# EAGLE design RJ45_Buffer (EAGLE 8.6.0)
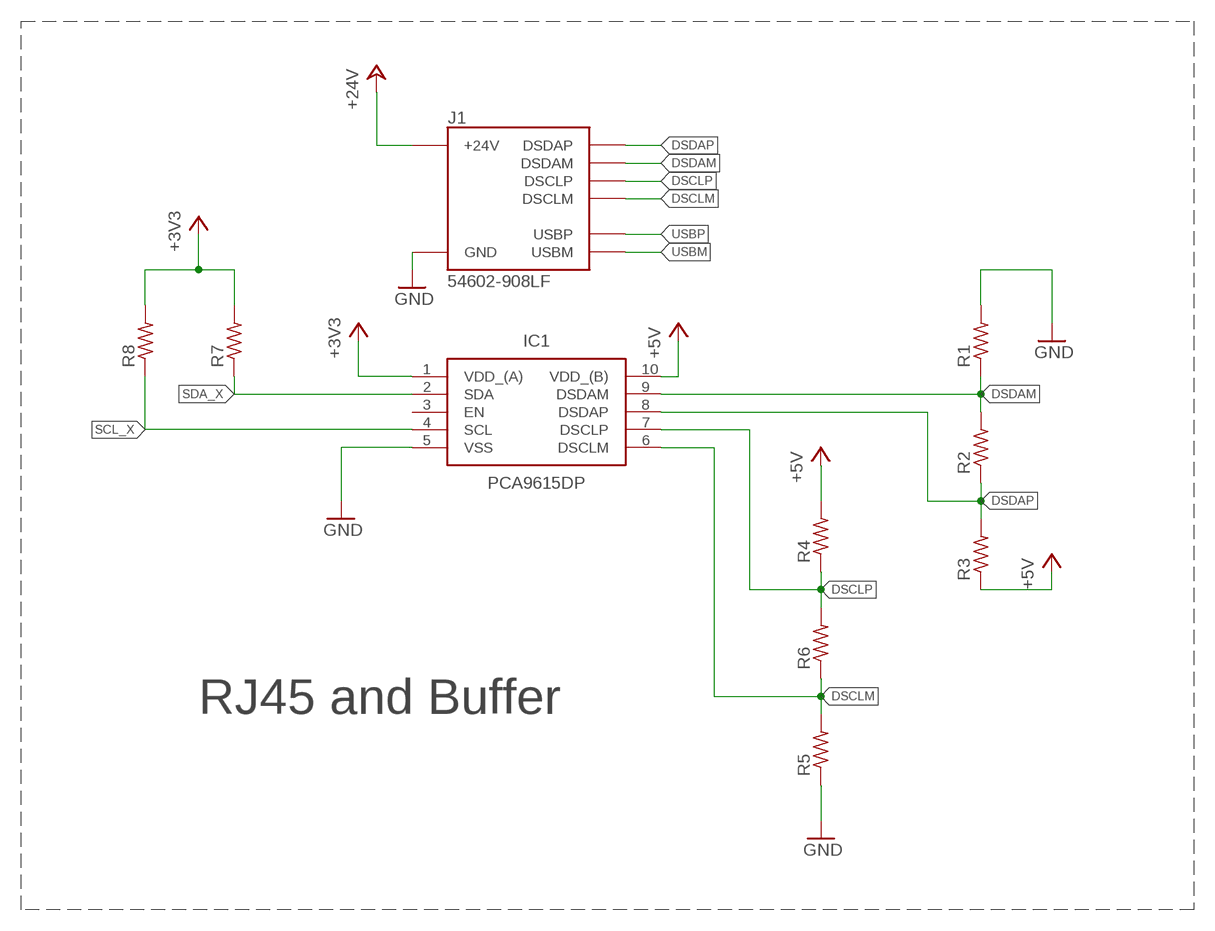
[diagram p0: schematic, sheet 1]

## Parts
IC1  PCA9615DP  [SOP50P490X110-10N]
J1  54602-908LF  OPENAG-V1-RJ45PTH  [OPENAG-V1-RJ45]
R1  R-US_R0603  [R0603]
R2  R-US_R0603  [R0603]
R3  R-US_R0603  [R0603]
R4  R-US_R0603  [R0603]
R5  R-US_R0603  [R0603]
R6  R-US_R0603  [R0603]
R7  R-US_R0603  [R0603]
R8  R-US_R0603  [R0603]

## Nets
+3V3: IC1.1(VDD_(A)) R7.2 R8.2
+5V: IC1.10(VDD_(B)) R3.1 R4.2
+24V: J1.24V(6)(+24V)
DSCLM: IC1.6(DSCLM) J1.DSCLM(5)(DSCLM) R5.2 R6.1
DSCLP: IC1.7(DSCLP) J1.DSCLP(4)(DSCLP) R4.1 R6.2
DSDAM: IC1.9(DSDAM) J1.DSDAM(2)(DSDAM) R1.1 R2.2
DSDAP: IC1.8(DSDAP) J1.DSDAP(1)(DSDAP) R2.1 R3.2
GND: IC1.5(VSS) J1.GND(3)(GND) R1.2 R5.1
SCL_X: IC1.4(SCL) R8.1
SDA_X: IC1.2(SDA) R7.1
USBM: J1.USBM(8)(USBM)
USBP: J1.USBP(7)(USBP)
Unconnected: IC1.3(EN)

## Notes on the sheet
- RJ45 and Buffer

## Library data of the parts
IC1 = PCA9615DP:PCA9615DP: Buffer, ReDriver 2 Channel 400kHz 10-TSSOP Source: Datasheet <http://www.nxp.com/docs/en/data-sheet/PCA9615.pdf>; DESCRIPTION: Buffer, ReDriver 2 Channel 400kHz 10-TSSOP; HEIGHT: 1.1mm; MANUFACTURER_NAME: Nexperia; MANUFACTURER_PART_NUMBER: PCA9615DP; SUPPLIER_NAME: RS
J1 = openag_connector:OPENAG-V1-RJ45: Amphenol FCI - 54602-908LF - CONN MOD JACK 8P8C R/A UNSHLD Description: Jack Modular Connector 8p8c (RJ45, Ethernet) 90� Angle (Right) Unshielded Cat3 Technical Specifications: Connector Type: Jack Number of Positions/Contacts: 8p8c (RJ45, Ethernet) Number of Ports: 1 Number of Rows: 1 Mounting Type: Through Hole Orientation: 90� Angle (Right) Termination: Solder Shielding: Unshielded Ratings: Cat3 Features: Board Lock LED Color: Does Not Contain LED Tab Direction: Down Contact Material: Copper Alloy Contact Finish: Gold Contact Finish Thickness: 15�in (0.38�m) Housing Material: Polyester, Glass Filled Operating Temperature: -40�C ~ 70�C Datasheet(s): 54601-x04(zzz)WPLF Drawing <http://cdn.amphenol-icc.com/media/wysiwyg/files/drawing/c-bmj-0102.pdf> Vendor(s): Digikey: 609-1046-ND <https://www.digikey.com/product-detail/en/amphenol-fci/54602-908LF/609-1046-ND/1001360>; POPULATE: YES; VERIFIED: NO
R1-R8 = rcl:R-US_: RESISTOR, American symbol; SPICEPREFIX: R

## Board
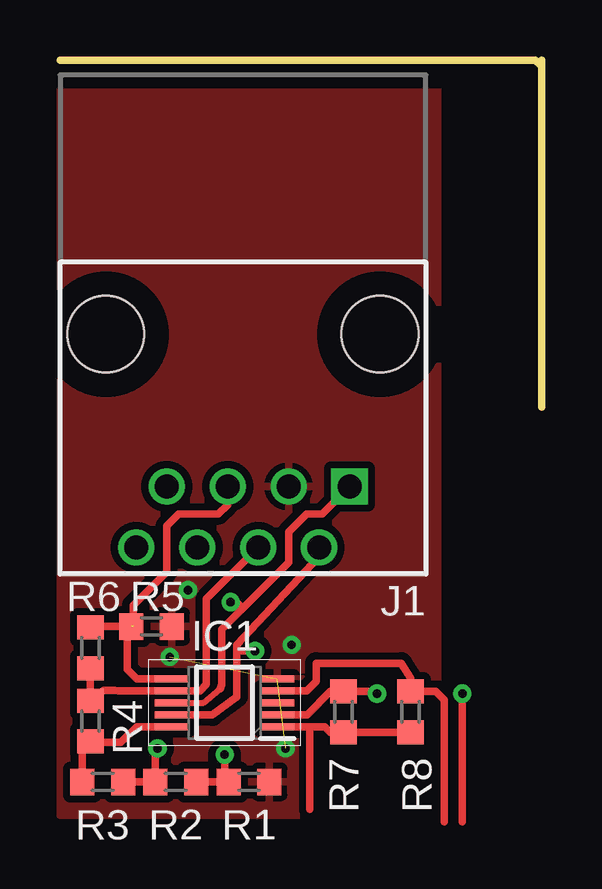
[diagram p1: board, top side]
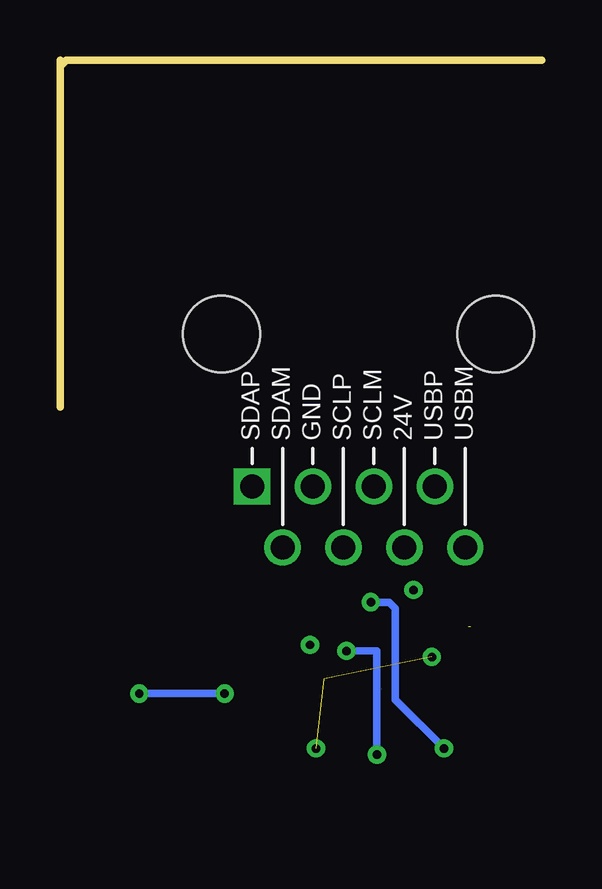
[diagram p2: board, bottom side, seen from below]

Size 20.07 x 14.48 mm. Coordinates in mm from the lower left corner, seen from the top.
Outline: 20.07,14.22 20.07,14.48 0,14.48 19.81,14.48 20.07,14.22
Outline: 20.07,14.22 20.07,0
Copper layers (1*16): Top 0.035mm / dielectric 1.5mm / Bottom 0.035mm
Design rules "default": minimum track width 6mil, minimum drill 0.35mm, track to track 6mil, track to pad 6mil, pad to pad 6mil, via to via 6mil, smd to smd 6mil, copper to edge 40mil, drill to drill 6mil, minimum pad ring 10mil, minimum via ring 8mil, stop-mask expansion 4mil, vias tented up to drill 0mil, thermal gap 10mil

### Footprints (pad centres in the part's own frame; a part is rotated, then mirrored left to right if it is on the bottom)
SOP50P490X110-10N = smd 1.4 x 0.3: 1 -2.2,1; 2 -2.2,0.5; 3 -2.2,0; 4 -2.2,-0.5; 5 -2.2,-1; 6 2.2,-1; 7 2.2,-0.5; 8 2.2,0; 9 2.2,0.5; 10 2.2,1
OPENAG-V1-RJ45 = drill 1: 24V(6) 1.905,8.89; DSCLM(5) 0.635,6.35; DSCLP(4) -0.635,8.89; DSDAM(2) -3.175,8.89; GND(3) -1.905,6.35; USBM(8) 4.445,8.89; USBP(7) 3.175,6.35 | drill 1 square: DSDAP(1) -4.445,6.35 | hole 3.2: -5.715,0; 5.715,0
R0603 = smd 1 x 1.1: 1 -0.85,0; 2 0.85,0

### Placement (x,y rotation side)
IC1  6.86,-12.32 180 top  (outside the outline)
J1  7.62,3.05 180 top
R1  7.87,-15.62 0 top  (outside the outline)
R2  4.83,-15.62 0 top  (outside the outline)
R3  1.78,-15.62 0 top  (outside the outline)
R4  1.27,-13.08 270 top  (outside the outline)
R5  3.81,-9.14 180 top  (outside the outline)
R6  1.27,-10.03 270 top  (outside the outline)
R7  11.81,-12.7 270 top  (outside the outline)
R8  14.61,-12.7 270 top  (outside the outline)

### Tracks (layer width: path | path; a pad name or v marks a point on that pad's centre or on a via)
+3V3
  Top 0.305: IC1.1 10.41,-13.32 | 10.41,-13.32 11.03,-13.32 11.26,-13.55 R7.2 R8.2 | 10.41,-13.32 10.41,-16.76
+5V
  Top 0.305: IC1.10 3.19,-13.32 2.54,-13.97 1.31,-13.97 R4.2 0.93,-14.27 R3.1
DSCLM  (1 unrouted)
  Top 0.305: R6.1 1.31,-9.14 2.79,-9.14 | 2.79,-9.14 R5.2 | IC1.6 3.19,-11.32 2.79,-10.92 2.79,-9.14 | 3.05,-9.14 3.05,-8.25 4.45,-6.86 4.45,-4.95 4.95,-4.44 6.6,-4.44 6.99,-4.06 J1.DSCLM(5)
DSCLP
  Top 0.305: R6.2 R4.1 1.82,-11.81 2.29,-11.81 2.42,-11.82 IC1.7 5.83,-11.82 6.1,-11.56 6.1,-8 J1.DSCLP(4)
DSDAM  (via drill 0.35)
  Top 0.305: J1.DSDAM(2) 10.79,-6.22 7.37,-9.91 7.37,-10.16 | IC1.9 6.35,-12.83 7.37,-12.06 7.37,-10.16 | R2.2 R1.1 arc-90 6.86,-15.45 v6.86,-14.48 6.86,-14.35 | v8.13,-10.16 7.37,-10.16
  Bottom 0.305: v6.86,-14.48 6.86,-10.16 v8.13,-10.16
DSDAP  (via drill 0.35)  (1 unrouted)
  Top 0.254: IC1.8 5.98,-12.32 6.68,-11.75
  Top 0.305: R3.2 R2.1 3.98,-14.31 v4.06,-14.22 | 6.68,-11.73 6.73,-11.56 6.73,-9.27 7.62,-8.38 | 7.62,-8.38 9.53,-6.48 9.53,-5.21 10.29,-4.44 10.92,-4.44 J1.DSDAP(1) | v7.11,-8.13 7.37,-8.13 7.62,-8.38
  Bottom 0.305: v4.06,-14.22 6.1,-12.19 6.1,-8.38 6.35,-8.13 v7.11,-8.13
GND  (via drill 0.35)  (2 unrouted)
  other vias: 9.65,-9.91 9.4,-14.22 4.57,-10.41 5.33,-7.62
  pour Top (isolate 0.305): 0,14.48 0,-17.02 15.75,-17.02 15.75,14.48 1.02,14.48
SCL_X
  Top 0.305: IC1.4 10.28,-11.82 10.67,-11.43 10.67,-10.67 14.22,-10.67 14.61,-11.3 R8.1 15.66,-11.85 16,-12.19 16,-13.97 16,-14.22 16,-17.27
SDA_X  (via drill 0.35)
  Top 0.305: IC1.2 10.29,-12.82 11.26,-11.85 R7.1 13.12,-11.85 v13.21,-11.94 | v16.76,-11.94 16.76,-17.27
  Bottom 0.305: v13.21,-11.94 v16.76,-11.94